# Altium schematic sheet 4_INPUT.SchDoc
size A4
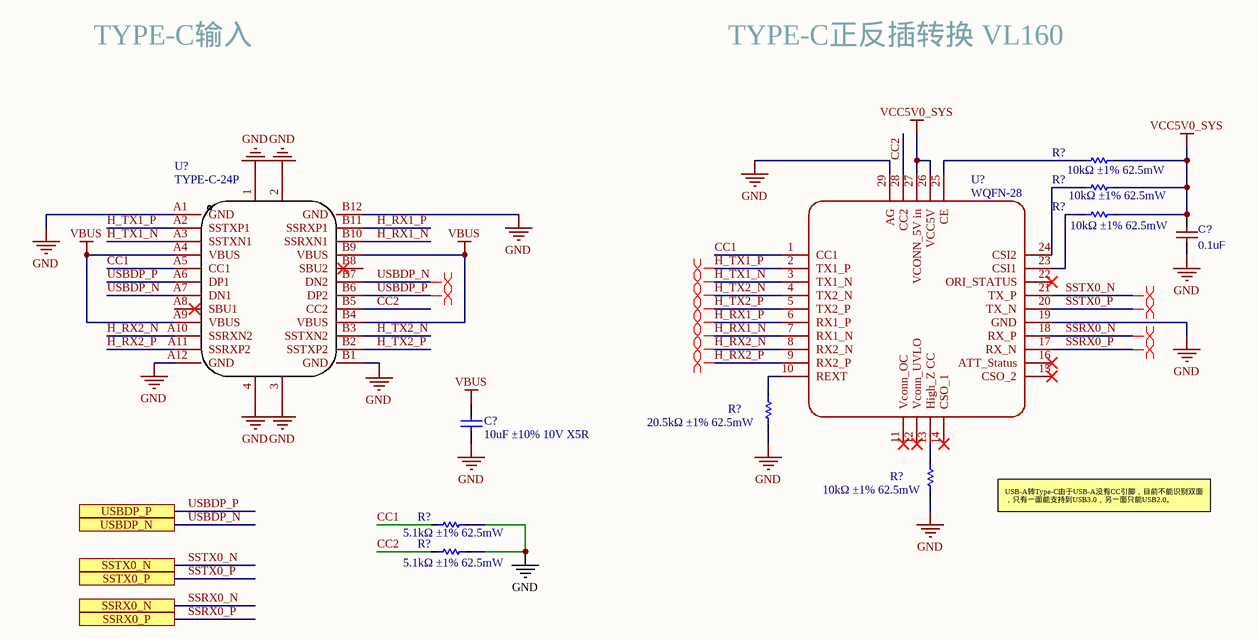
[diagram p0: 4_INPUT.SchDoc]

## Parts
(Parts that share a designator on the sheet are numbered #1, #2 ... from top to bottom, then left to right.)
C?#1  0.1uF  [C0603]
C?#2  10uF ±10% 10V X5R  [C0603]
R?#1  10kΩ ±1% 62.5mW  [R0402]
R?#2  10kΩ ±1% 62.5mW  [R0402]
R?#3  10kΩ ±1% 62.5mW  [R0402]
R?#4  20.5kΩ ±1% 62.5mW  [R0402]
R?#5  10kΩ ±1% 62.5mW  [R0402]
R?#6  5.1kΩ ±1% 62.5mW  [R0402]
R?#7  5.1kΩ ±1% 62.5mW  [R0402]
U?#1  TYPE-C-24P  [TYPE-C-24P]
U?#2  WQFN-28  [WQFN-28]

## Ports
SSRX0_N, SSRX0_P, SSTX0_N, SSTX0_P, USBDP_N, USBDP_P

## Nets
GND: C?#1.2 C?#2.1 R?#4.2 R?#5.2 R?#6.1 R?#7.1 U?#1.1 U?#1.2 U?#1.3 U?#1.4 U?#1.A1(GND) U?#1.A12(GND) U?#1.B1(GND) U?#1.B12(GND) U?#2.19(GND) U?#2.29(AG)
VBUS: C?#2.2 U?#1.A4(VBUS) U?#1.A9(VBUS) U?#1.B4(VBUS) U?#1.B9(VBUS)
VCC5V0_SYS: C?#1.1 R?#1.2 R?#2.2 R?#3.2 U?#2.26(VCC5V) U?#2.27(VCONN_5V_in)
CC1: R?#6.2 U?#1.A5(CC1) U?#2.1(CC1)
CC2: R?#7.2 U?#1.B5(CC2) U?#2.28(CC2)
H_RX1_N: U?#1.B10(SSRXN1) U?#2.7(RX1_N)
H_RX1_P: U?#1.B11(SSRXP1) U?#2.6(RX1_P)
H_RX2_N: U?#1.A10(SSRXN2) U?#2.8(RX2_N)
H_RX2_P: U?#1.A11(SSRXP2) U?#2.9(RX2_P)
H_TX1_N: U?#1.A3(SSTXN1) U?#2.3(TX1_N)
H_TX1_P: U?#1.A2(SSTXP1) U?#2.2(TX1_P)
H_TX2_N: U?#1.B3(SSTXN2) U?#2.4(TX2_N)
H_TX2_P: U?#1.B2(SSTXP2) U?#2.5(TX2_P)
SSRX0_N: U?#2.18(RX_P) ; port SSRX0_N
SSRX0_P: U?#2.17(RX_N) ; port SSRX0_P
SSTX0_N: U?#2.21(TX_P) ; port SSTX0_N
SSTX0_P: U?#2.20(TX_N) ; port SSTX0_P
USBDP_N: U?#1.A7(DN1) U?#1.B7(DN2) ; port USBDP_N
USBDP_P: U?#1.A6(DP1) U?#1.B6(DP2) ; port USBDP_P
NetR?#1_1: R?#1.1 U?#2.25(CE)
NetR?#2_1: R?#2.1 U?#2.24(CSI2)
NetR?#3_1: R?#3.1 U?#2.23(CSI1)
NetR?#4_1: R?#4.1 U?#2.10(REXT)
NetR?#5_1: R?#5.1 U?#2.13(High_Z_CC)

Not connected (* = marked no-connect by the designer): U?#1 A8(SBU1) B8(SBU2); U?#2 11(Vconn_OC)* 12(Vconn_UVLO)* 14(CSO_1)* 15(CSO_2)* 16(ATT_Status)* 22(ORI_STATUS)*

## Layout directives
differential pair: H_RX1_N, H_RX1_P, H_RX2_N, H_RX2_P, H_TX1_N, H_TX1_P, H_TX2_N, H_TX2_P, SSRX0_N, SSRX0_P, SSTX0_N, SSTX0_P, USBDP_N, USBDP_P

## Notes on the sheet
- TYPE-C输入
- TYPE-C正反插转换 VL160
- USB-A转Type-C由于USB-A没有CC引脚，目前不能识别双面，只有一面能支持到USB3.0，另一面只能USB2.0。

## Library data of the parts
C?#1 = C: BOM_Manufacturer: FH; BOM_Manufacturer Part: 0603F104M500NT; nameAlias: Capacitance; BOM_Supplier: LCSC; BOM_Supplier Part: C42998; BOM_JLCPCB Part Class: Extended Part; spicePre: C; spiceSymbolName: 0603F104M500NT
C?#2 = C0603: Capacitor; Published: 8-Jun-2000; LatestRevisionDate: 17-Jul-2002; LatestRevisionNote: Re-released for DXP Platform.; PackageReference: RAD-0.3; Publisher: Altium Limited; PackageDescription: Radial Cap, Thru-Hole; 2 Leads; 0.3 in Pin Spacing
R?#1-R?#7 = R0402: Resistor; Published: 8-Jun-2000; LatestRevisionDate: 17-Jul-2002; LatestRevisionNote: Re-released for DXP Platform.; PackageReference: AXIAL-0.3; Publisher: Altium Limited; PackageDescription: Axial Device, Thru-Hole; 2 Leads; 0.3 in Pin Spacing
U?#2 = VL160
U?#1 = TYPE-C-24P: Parameter 1: *